# EAGLE schematic untitled (EAGLE 9.6.2)
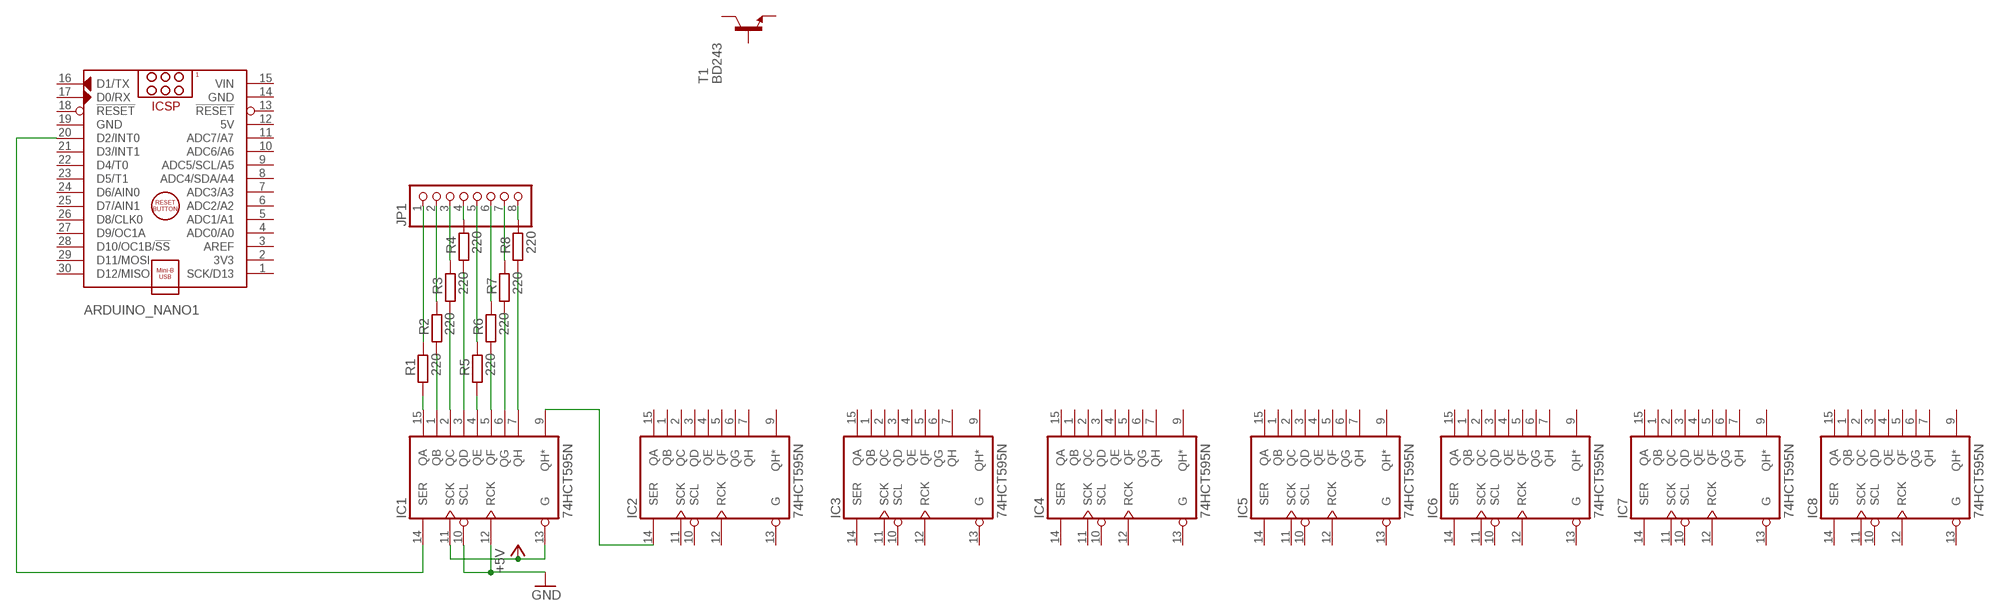
[diagram p0: schematic, sheet 1]

## Parts
ARDUINO_NANO1  ARDUINO_NANO  [ARDUINO_NANO]
IC1  74HCT595N  [DIL16]
IC2  74HCT595N  [DIL16]
IC3  74HCT595N  [DIL16]
IC4  74HCT595N  [DIL16]
IC5  74HCT595N  [DIL16]
IC6  74HCT595N  [DIL16]
IC7  74HCT595N  [DIL16]
IC8  74HCT595N  [DIL16]
JP1  PINHD-1X8  [1X08]
R1  220  R-EU_0309/12  [0309/12]
R2  220  R-EU_0309/12  [0309/12]
R3  220  R-EU_0309/12  [0309/12]
R4  220  R-EU_0309/12  [0309/12]
R5  220  R-EU_0309/12  [0309/12]
R6  220  R-EU_0309/12  [0309/12]
R7  220  R-EU_0309/12  [0309/12]
R8  220  R-EU_0309/12  [0309/12]
T1  BD243  [TO220]

## Nets
+5V: IC1.11(SCK) IC1.13(G)
GND: IC1.10(SCL) IC1.12(RCK)
N$1: IC1.15(QA) R1.1
N$2: IC1.1(QB) R2.1
N$3: IC1.2(QC) R3.1
N$4: IC1.3(QD) R4.1
N$5: IC1.4(QE) R5.1
N$6: IC1.5(QF) R6.1
N$7: IC1.6(QG) R7.1
N$8: IC1.7(QH) R8.1
N$9: IC1.9(QH*) IC2.14(SER)
N$10: JP1.8 R8.2
N$11: JP1.7 R7.2
N$12: JP1.6 R6.2
N$13: JP1.5 R5.2
N$14: JP1.4 R4.2
N$15: JP1.3 R3.2
N$16: JP1.2 R2.2
N$17: JP1.1 R1.2
N$18: ARDUINO_NANO1.20(D2/INT0) IC1.14(SER)
Unconnected: ARDUINO_NANO1.1(SCK/D13) ARDUINO_NANO1.2(3V3) ARDUINO_NANO1.3(AREF) ARDUINO_NANO1.4(ADC0/A0) ARDUINO_NANO1.5(ADC1/A1) ARDUINO_NANO1.6(ADC2/A2) ARDUINO_NANO1.7(ADC3/A3) ARDUINO_NANO1.8(ADC4/SDA/A4) ARDUINO_NANO1.9(ADC5/SCL/A5) ARDUINO_NANO1.10(ADC6/A6) ARDUINO_NANO1.11(ADC7/A7) ARDUINO_NANO1.13(!RESET) ARDUINO_NANO1.16(D1/TX) ARDUINO_NANO1.17(D0/RX) ARDUINO_NANO1.18(!RESET) ARDUINO_NANO1.21(D3/INT1) ARDUINO_NANO1.22(D4/T0) ARDUINO_NANO1.23(D5/T1) ARDUINO_NANO1.24(D6/AIN0) ARDUINO_NANO1.25(D7/AIN1) ARDUINO_NANO1.26(D8/CLK0) ARDUINO_NANO1.27(D9/OC1A) ARDUINO_NANO1.28(D10/OC1B/!SS) ARDUINO_NANO1.29(D11/MOSI) ARDUINO_NANO1.30(D12/MISO) IC2.1(QB) IC2.2(QC) IC2.3(QD) IC2.4(QE) IC2.5(QF) IC2.6(QG) IC2.7(QH) IC2.9(QH*) IC2.10(SCL) IC2.11(SCK) IC2.12(RCK) IC2.13(G) IC2.15(QA) IC3.1(QB) IC3.2(QC) IC3.3(QD) IC3.4(QE) IC3.5(QF) IC3.6(QG) IC3.7(QH) IC3.9(QH*) IC3.10(SCL) IC3.11(SCK) IC3.12(RCK) IC3.13(G) IC3.14(SER) IC3.15(QA) IC4.1(QB) IC4.2(QC) IC4.3(QD) IC4.4(QE) IC4.5(QF) IC4.6(QG) IC4.7(QH) IC4.9(QH*) IC4.10(SCL) IC4.11(SCK) IC4.12(RCK) IC4.13(G) IC4.14(SER) IC4.15(QA) IC5.1(QB) IC5.2(QC) IC5.3(QD) IC5.4(QE) IC5.5(QF) IC5.6(QG) IC5.7(QH) IC5.9(QH*) IC5.10(SCL) IC5.11(SCK) IC5.12(RCK) IC5.13(G) IC5.14(SER) IC5.15(QA) IC6.1(QB) IC6.2(QC) IC6.3(QD) IC6.4(QE) IC6.5(QF) IC6.6(QG) IC6.7(QH) IC6.9(QH*) IC6.10(SCL) IC6.11(SCK) IC6.12(RCK) IC6.13(G) IC6.14(SER) IC6.15(QA) IC7.1(QB) IC7.2(QC) IC7.3(QD) IC7.4(QE) IC7.5(QF) IC7.6(QG) IC7.7(QH) IC7.9(QH*) IC7.10(SCL) IC7.11(SCK) IC7.12(RCK) IC7.13(G) IC7.14(SER) IC7.15(QA) IC8.1(QB) IC8.2(QC) IC8.3(QD) IC8.4(QE) IC8.5(QF) IC8.6(QG) IC8.7(QH) IC8.9(QH*) IC8.10(SCL) IC8.11(SCK) IC8.12(RCK) IC8.13(G) IC8.14(SER) IC8.15(QA) T1.1(B) T1.2(C) T1.3(E)

## Power pins joined to a net without a drawn wire
5V: ARDUINO_NANO1.12(5V)
GND: ARDUINO_NANO1.14(GND) ARDUINO_NANO1.19(GND) IC1.8(GND) IC2.8(GND) IC3.8(GND) IC4.8(GND) IC5.8(GND) IC6.8(GND) IC7.8(GND) IC8.8(GND)
VCC: IC1.16(VCC) IC2.16(VCC) IC3.16(VCC) IC4.16(VCC) IC5.16(VCC) IC6.16(VCC) IC7.16(VCC) IC8.16(VCC)
VIN: ARDUINO_NANO1.15(VIN)

## Library data of the parts
ARDUINO_NANO1 = ArduinoNanoV30:ARDUINO_NANO: Arduino Nano V3.0 Module Overview: The Arduino Nano is a small, complete, and breadboard-friendly board based on the ATmega328 (Arduino Nano 3.x) or ATmega168 (Arduino Nano 2.x). It has more or less the same functionality of the Arduino Duemilanove, but in a different package. It lacks only a DC power jack, and works with a Mini-B USB cable instead of a standard one. The Nano was designed and is being produced by Gravitech <http://www.gravitech.us/arna30wiatp.html>. General specifications: Item Value Microcontroller Atmel ATmega168 or ATmega328 Operating Voltage (logic level) 5 V Input Voltage (recommended) 7-12 V Input Voltage (limits) 6-20 V Digital I/O Pins 14 (of which 6 provide PWM output) Analog Input Pins 8 DC Current per I/O Pin 40 mA Flash Memory 16 KB (ATmega168) or 32 KB (ATmega328) of which 2 KB used by bootloader SRAM 1 KB (ATmega168) or 2 KB (ATmega328) EEPROM 512 bytes (ATmega168) or 1 KB (ATmega328) Clock Speed 16 MHz Dimensions (Inches) 0.73" x 1.70" Dimensions (mm) 18mm x 45mm Overall height About 9 mm (not including pins) Weigth 5 g Power: The Arduino Nano can be powered via the Mini-B USB connection, 6-20V unregulated external power supply (pin 30), or 5V regulated external power supply (pin 27). The power source is automatically selected to the highest voltage source. Memory: The ATmega168 has 16 KB of flash memory for storing code (of which 2 KB is used for the bootloader); the ATmega328 has 32 KB, (also with 2 KB used for the bootloader). The ATmega168 has 1 KB of SRAM and 512 bytes of EEPROM (which can be read and written with the EEPROM library); the ATmega328 has 2 KB of SRAM and 1 KB of EEPROM. Input and Output: Each of the 14 digital pins on the Nano can be used as an input or output, using pinMode(), digitalWrite(), and digitalRead() functions. They operate at 5 volts. Each pin can provide or receive a maximum of 40 mA and has an internal pull-up resistor (disconnected by default) of 20-50 kOhms. In addition, some pins have specialized functions. Visit Arduino - ArduinoBoardNano <https://www.arduino.cc/en/Main/ArduinoBoardNano>
IC1-IC8 = 74xx-eu:74*595: 8-bit SHIFT REGISTER, output latch
JP1 = pinhead:PINHD-1X8: PIN HEADER
R1-R8 = rcl:R-EU_: RESISTOR, European symbol; SPICEPREFIX: R
T1 = transistor:BD243: NPN TRANSISTOR Source: Motorola Semiconductor, Master Selection Guide Q3/95 SG73 REV 8 page 5.5-4